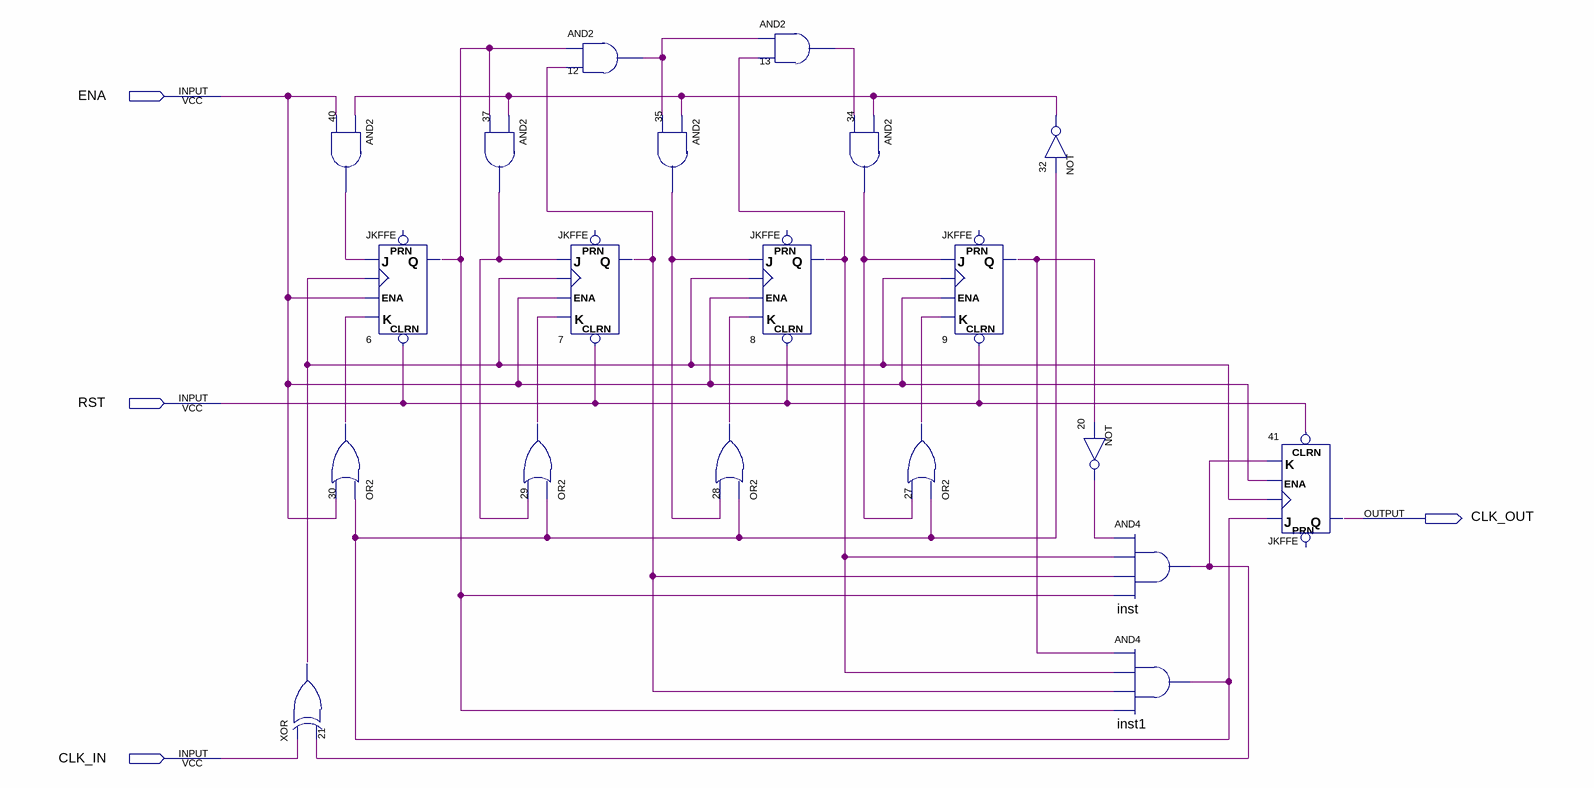
[diagram p0: schematic sheet]
// Quartus schematic div15.bdf as structural Verilog: 20 symbols, 4 pins
module div15 (
  input  ENA,
  input  RST,
  input  CLK_IN,
  output CLK_OUT
);

  wire inst1_out, inst_out, n6_q, n7_q, n8_q, n9_q, n12_out, n13_out, n20_out, n21_out, n27_out, n28_out,
       n29_out, n30_out, n32_out, n34_out, n35_out, n37_out, n40_out;

  xor u_21 (n21_out, CLK_IN, inst_out);
  and u_40 (n40_out, n32_out, ENA);
  JKFFE u_6 (.J(n40_out), .CLK(n21_out), .CLRN(RST), .K(n30_out), .ENA(ENA), .Q(n6_q));  // open: PRN
  or u_30 (n30_out, inst1_out, ENA);
  and u_37 (n37_out, n32_out, n6_q);
  or u_29 (n29_out, inst1_out, n37_out);
  and u_12 (n12_out, n6_q, n7_q);
  JKFFE u_7 (.J(n37_out), .CLK(n21_out), .CLRN(RST), .K(n29_out), .ENA(ENA), .Q(n7_q));  // open: PRN
  and u_35 (n35_out, n32_out, n12_out);
  and u_13 (n13_out, n12_out, n8_q);
  JKFFE u_8 (.J(n35_out), .CLK(n21_out), .CLRN(RST), .K(n28_out), .ENA(ENA), .Q(n8_q));  // open: PRN
  or u_28 (n28_out, inst1_out, n35_out);
  and u_34 (n34_out, n32_out, n13_out);
  or u_27 (n27_out, inst1_out, n34_out);
  JKFFE u_9 (.J(n34_out), .CLK(n21_out), .CLRN(RST), .K(n27_out), .ENA(ENA), .Q(n9_q));  // open: PRN
  not u_32 (n32_out, inst1_out);
  not u_20 (n20_out, n9_q);
  and inst (inst_out, n20_out, n8_q, n7_q, n6_q);
  and inst1 (inst1_out, n9_q, n8_q, n7_q, n6_q);
  JKFFE u_41 (.J(inst1_out), .CLK(n21_out), .CLRN(RST), .K(inst_out), .ENA(ENA), .Q(CLK_OUT));  // open: PRN
endmodule
